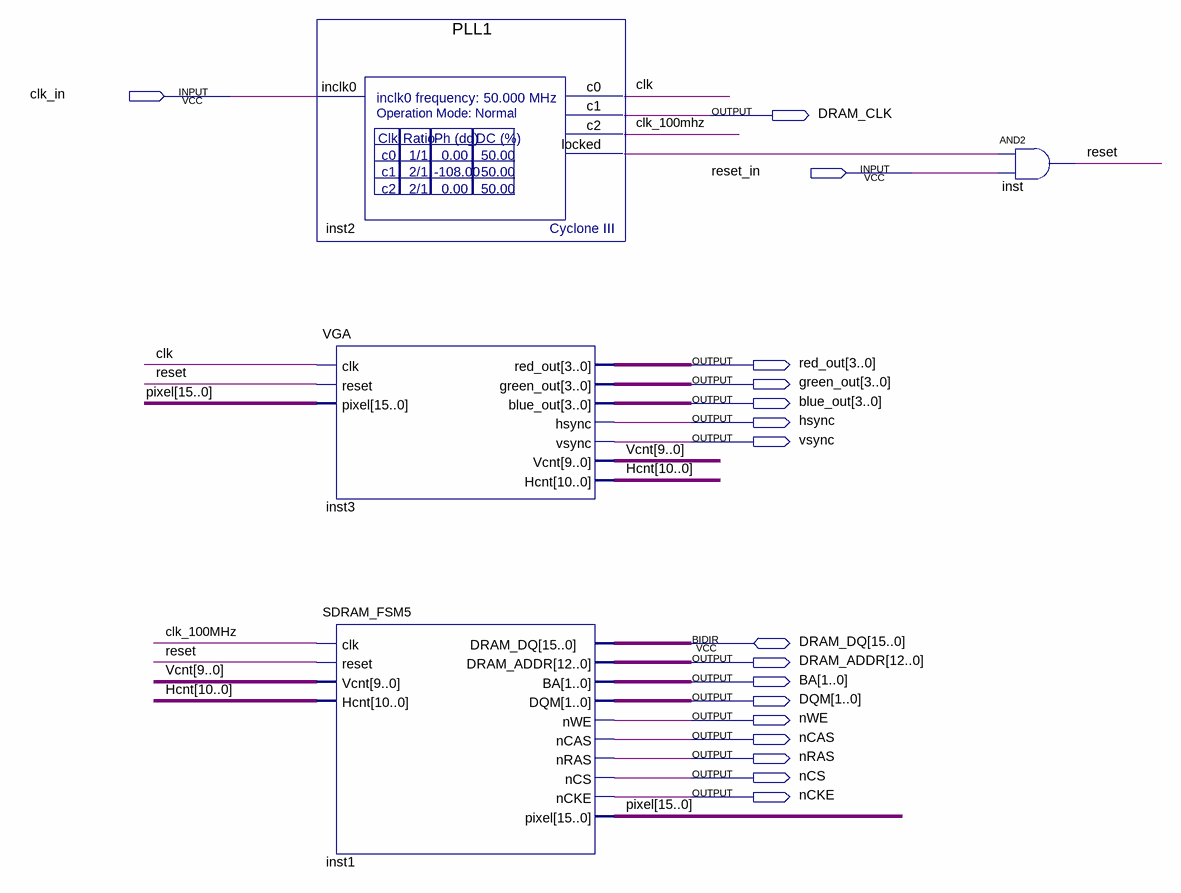
[diagram p0: schematic sheet]
// Quartus schematic SDRAMreader.bdf as structural Verilog: 4 symbols, 17 pins
module SDRAMreader (
  input  clk_in,
  input  reset_in,
  inout  [15:0] DRAM_DQ,
  output DRAM_CLK,
  output [3:0] red_out,
  output [3:0] green_out,
  output [3:0] blue_out,
  output hsync,
  output vsync,
  output [12:0] DRAM_ADDR,
  output [1:0] BA,
  output [1:0] DQM,
  output nWE,
  output nCAS,
  output nRAS,
  output nCS,
  output nCKE
);

  wire clk, clk_100mhz, inst2_locked, reset;
  wire [9:0] Vcnt;
  wire [10:0] Hcnt;
  wire [15:0] pixel;

  PLL1 inst2 (.inclk0(clk_in), .c0(clk), .c1(DRAM_CLK), .c2(clk_100mhz), .locked(inst2_locked));
  VGA inst3 (
    .clk(clk), .reset(reset), .pixel(pixel), .red_out(red_out), .green_out(green_out), .blue_out(blue_out),
    .hsync(hsync), .vsync(vsync), .Vcnt(Vcnt), .Hcnt(Hcnt));
  SDRAM_FSM5 inst1 (
    .clk(clk_100mhz), .reset(reset), .Vcnt(Vcnt), .Hcnt(Hcnt), .DRAM_ADDR(DRAM_ADDR), .BA(BA), .DQM(DQM),
    .nWE(nWE), .nCAS(nCAS), .nRAS(nRAS), .nCS(nCS), .nCKE(nCKE), .pixel(pixel), .DRAM_DQ(DRAM_DQ));
  and inst (reset, inst2_locked, reset_in);
endmodule
